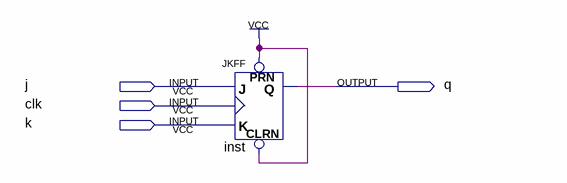
[diagram p0: schematic sheet]
// Quartus schematic simplejk.bdf as structural Verilog: 1 symbols, 4 pins
module simplejk (
  input  j,
  input  clk,
  input  k,
  output q
);

  JKFF inst (.PRN(1'b1), .CLRN(1'b1), .K(k), .J(j), .CLK(clk), .Q(q));
endmodule
